# EAGLE design vent bjt2 i2c pwm small (EAGLE 9.5.0)
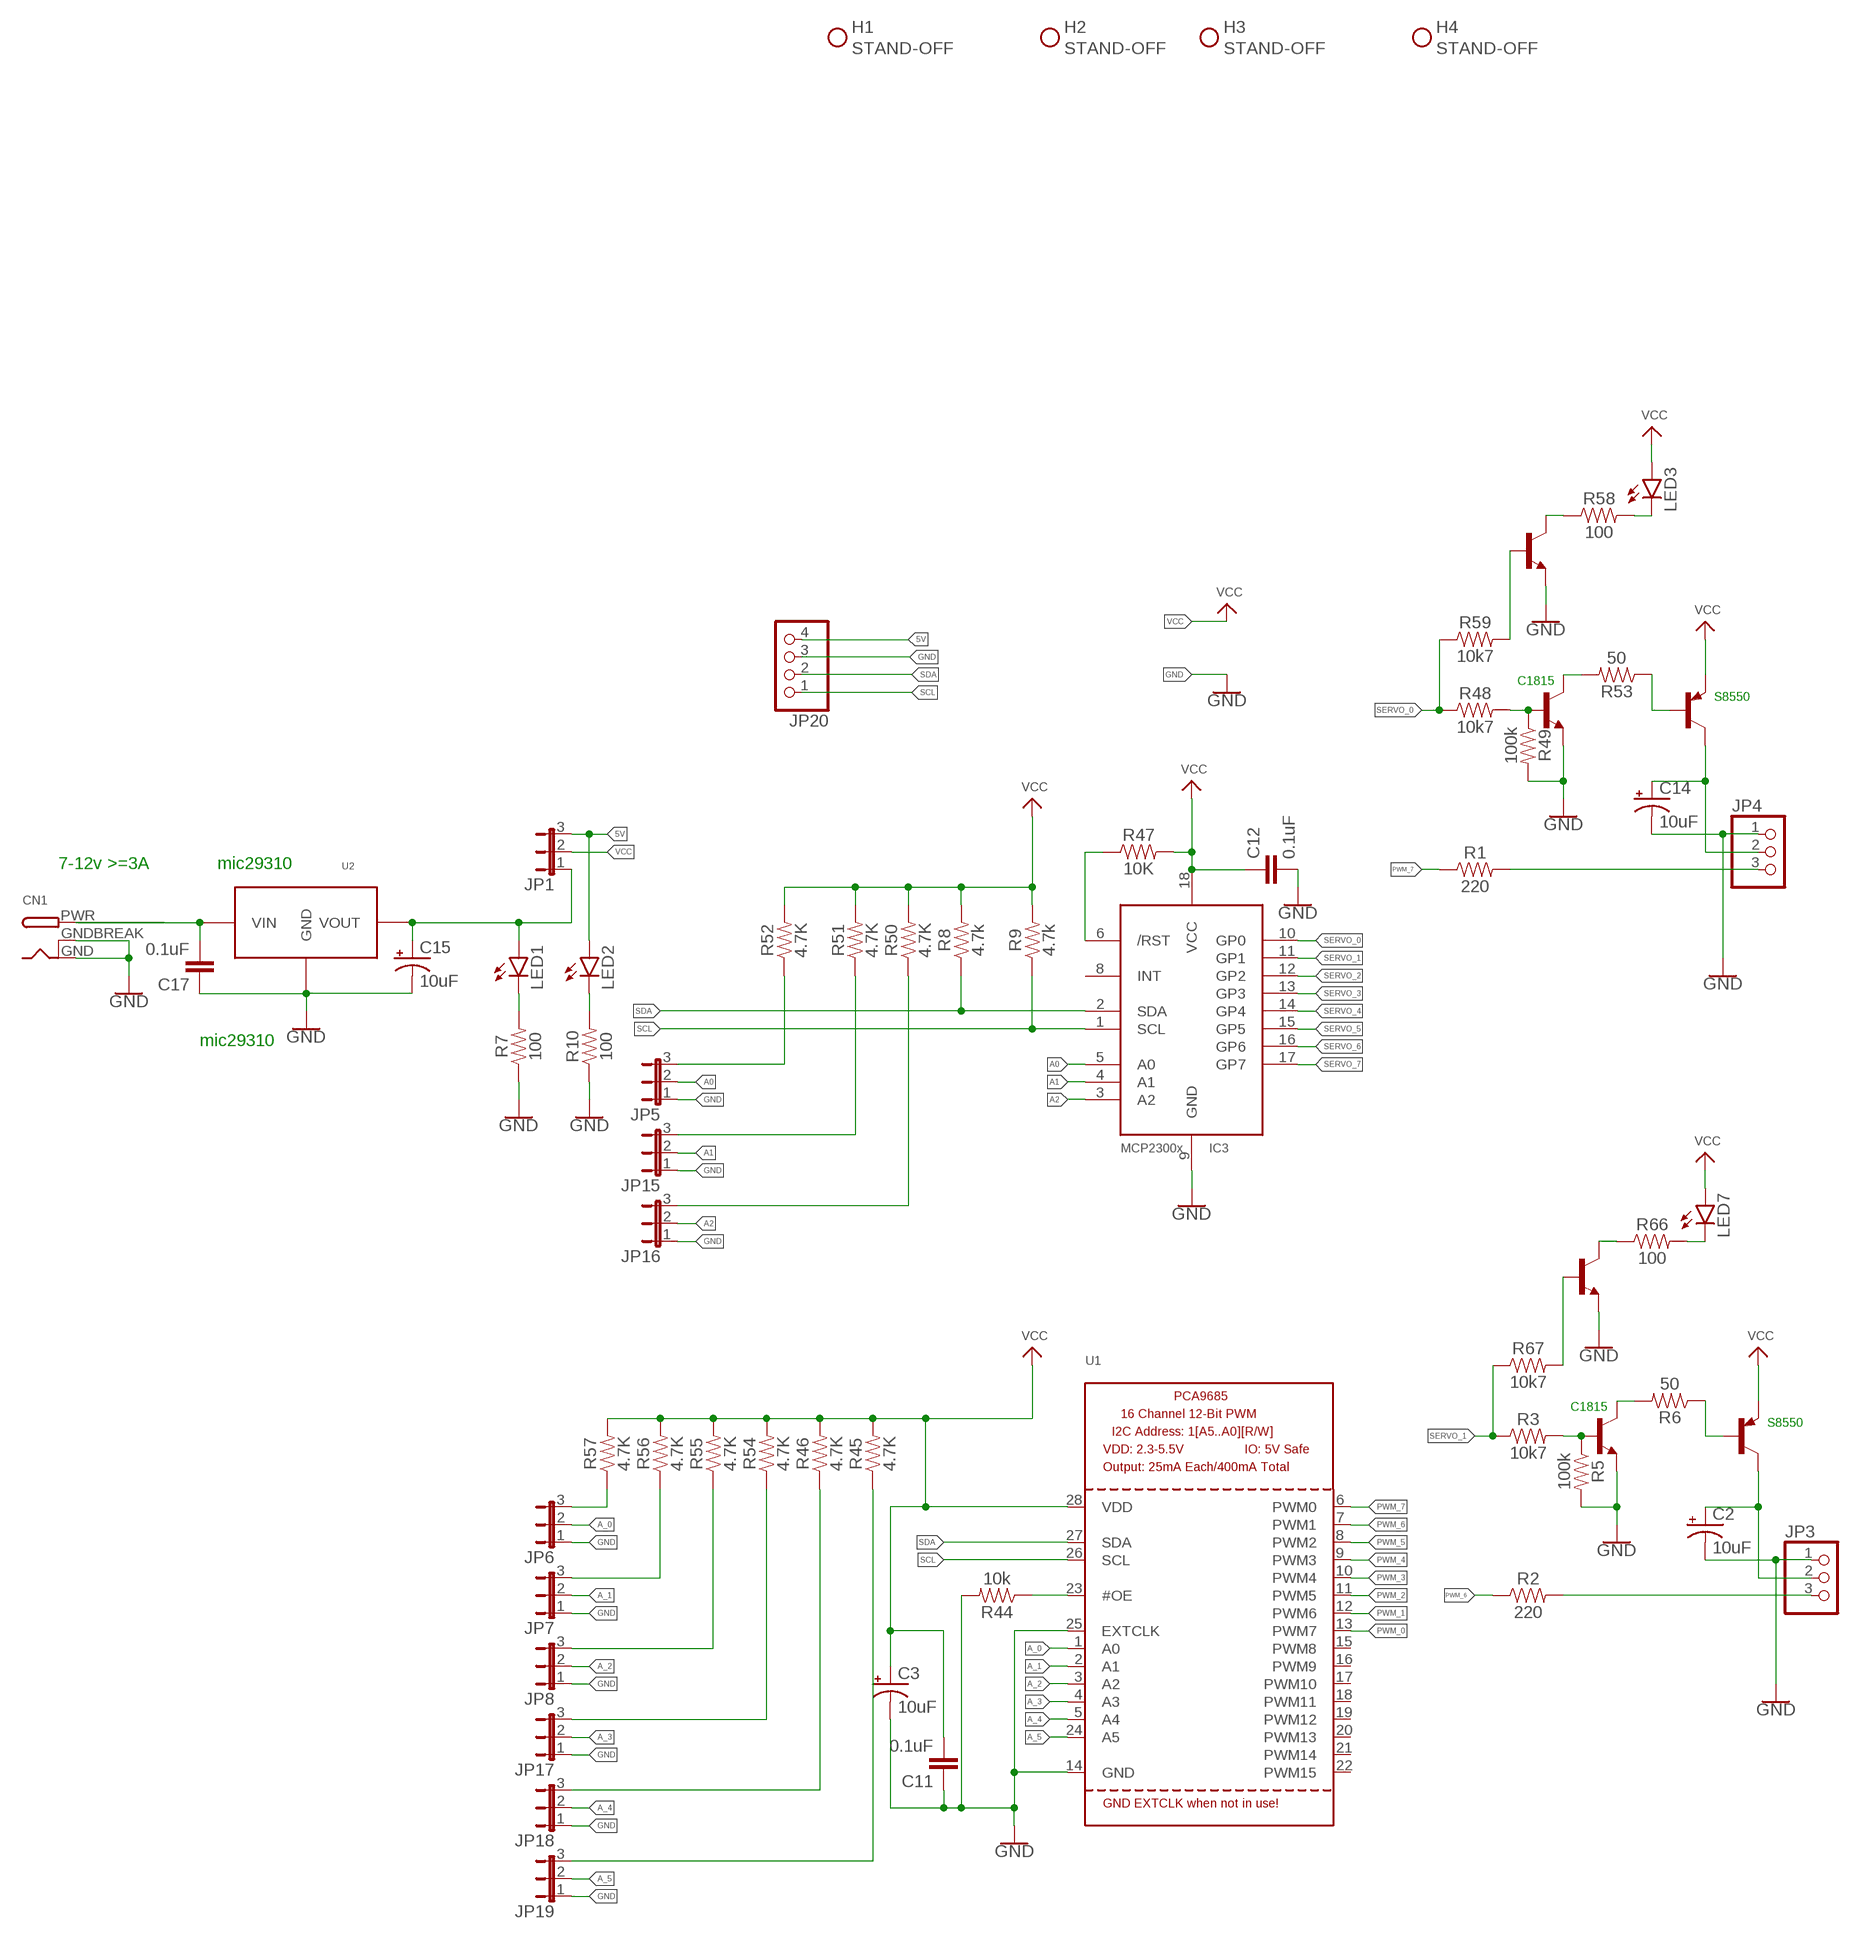
[diagram p0: schematic, sheet 1, part 1 of 2]
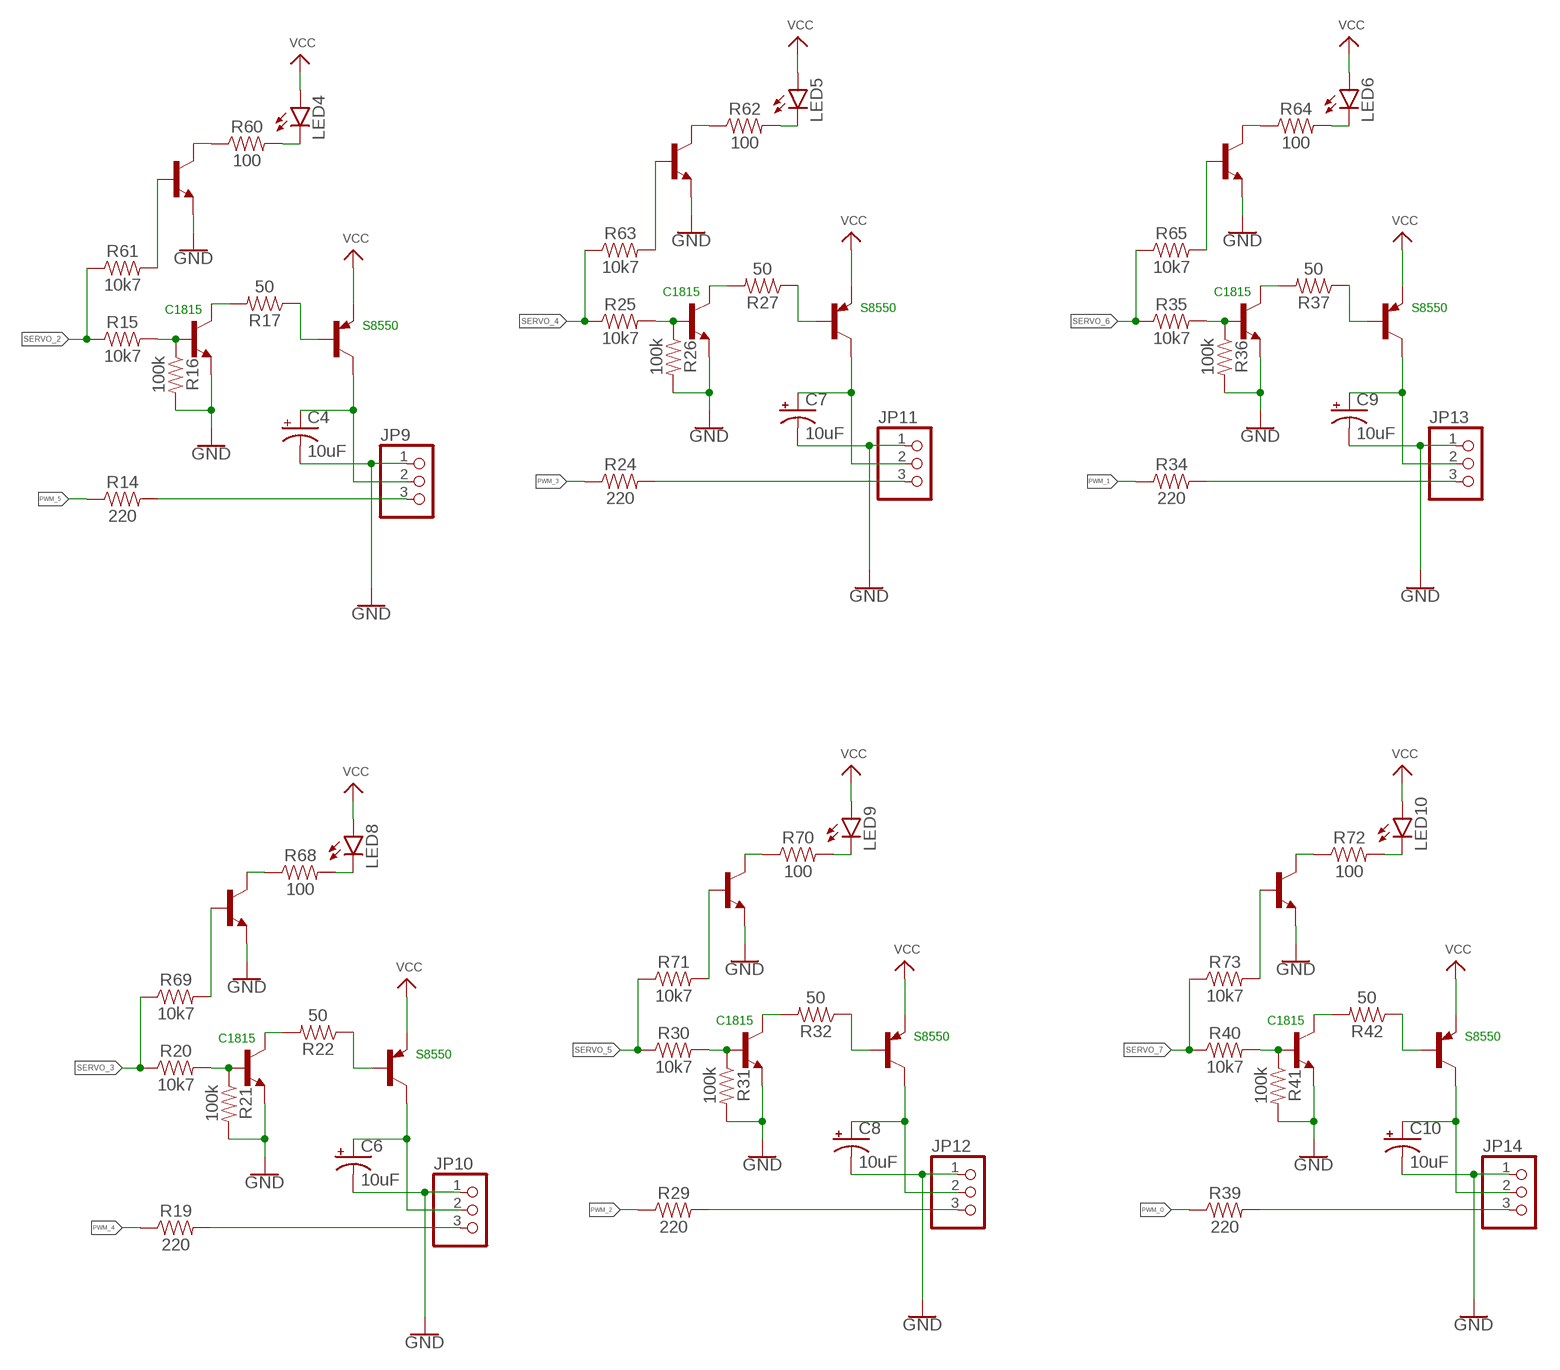
[diagram p1: schematic, sheet 1, part 2 of 2]

## Parts
C2  10uF  10UF-POLAR-RADIAL-2.5MM-25V-20%  [CPOL-RADIAL-2.5MM-5MM]
C3  10uF  10UF-POLAR-RADIAL-2.5MM-25V-20%  [CPOL-RADIAL-2.5MM-5MM]
C4  10uF  10UF-POLAR-RADIAL-2.5MM-25V-20%  [CPOL-RADIAL-2.5MM-5MM]
C6  10uF  10UF-POLAR-RADIAL-2.5MM-25V-20%  [CPOL-RADIAL-2.5MM-5MM]
C7  10uF  10UF-POLAR-RADIAL-2.5MM-25V-20%  [CPOL-RADIAL-2.5MM-5MM]
C8  10uF  10UF-POLAR-RADIAL-2.5MM-25V-20%  [CPOL-RADIAL-2.5MM-5MM]
C9  10uF  10UF-POLAR-RADIAL-2.5MM-25V-20%  [CPOL-RADIAL-2.5MM-5MM]
C10  10uF  10UF-POLAR-RADIAL-2.5MM-25V-20%  [CPOL-RADIAL-2.5MM-5MM]
C11  0.1uF  0.1UF-KIT-EZ-50V-20%  [CAP-PTH-SMALL-KIT]
C12  0.1uF  0.1UF-KIT-EZ-50V-20%  [CAP-PTH-SMALL-KIT]
C14  10uF  10UF-POLAR-RADIAL-2.5MM-25V-20%  [CPOL-RADIAL-2.5MM-5MM]
C15  10uF  10UF-POLAR-RADIAL-2.5MM-25V-20%  [CPOL-RADIAL-2.5MM-5MM]
C17  0.1uF  0.1UF-KIT-EZ-50V-20%  [CAP-PTH-SMALL-KIT]
CN1  DCBARRELPTH  [DCJACK_2MM_PTH]
H1  STAND-OFF  [STAND-OFF]
H2  STAND-OFF  [STAND-OFF]
H3  STAND-OFF  [STAND-OFF]
H4  STAND-OFF  [STAND-OFF]
IC3  MCP23008/P  [DIL18]
JP1  JP2E  [JP2]
JP3  PINHD-1X3  [1X03]
JP4  PINHD-1X3  [1X03]
JP5  JP2E  [JP2]
JP6  JP2E  [JP2]
JP7  JP2E  [JP2]
JP8  JP2E  [JP2]
JP9  PINHD-1X3  [1X03]
JP10  PINHD-1X3  [1X03]
JP11  PINHD-1X3  [1X03]
JP12  PINHD-1X3  [1X03]
JP13  PINHD-1X3  [1X03]
JP14  PINHD-1X3  [1X03]
JP15  JP2E  [JP2]
JP16  JP2E  [JP2]
JP17  JP2E  [JP2]
JP18  JP2E  [JP2]
JP19  JP2E  [JP2]
JP20  PINHD-1X4  [1X04]
LED1  LEDCHIPLED_1206  [CHIPLED_1206]
LED2  LEDCHIPLED_1206  [CHIPLED_1206]
LED3  LEDCHIPLED_1206  [CHIPLED_1206]
LED4  LEDCHIPLED_1206  [CHIPLED_1206]
LED5  LEDCHIPLED_1206  [CHIPLED_1206]
LED6  LEDCHIPLED_1206  [CHIPLED_1206]
LED7  LEDCHIPLED_1206  [CHIPLED_1206]
LED8  LEDCHIPLED_1206  [CHIPLED_1206]
LED9  LEDCHIPLED_1206  [CHIPLED_1206]
LED10  LEDCHIPLED_1206  [CHIPLED_1206]
Q1  2N2907  [TO92-EBC-OVAL]
Q2  2N2907  [TO92-EBC-OVAL]
Q3  2N2907  [TO92-EBC-OVAL]
Q4  2N2907  [TO92-EBC-OVAL]
Q5  2N2907  [TO92-EBC-OVAL]
Q6  2N2907  [TO92-EBC-OVAL]
Q7  2N2907  [TO92-EBC-OVAL]
Q9  2N2907  [TO92-EBC-OVAL]
R1  220  10KOHM-HORIZ-1/4W-1%  [AXIAL-0.3]
R2  220  10KOHM-HORIZ-1/4W-1%  [AXIAL-0.3]
R3  10k7  10KOHM-HORIZ-1/4W-1%  [AXIAL-0.3]
R5  100k  10KOHM-HORIZ-1/4W-1%  [AXIAL-0.3]
R6  50  10KOHM-HORIZ-1/4W-1%  [AXIAL-0.3]
R7  100  10KOHM-HORIZ-1/4W-1%  [AXIAL-0.3]
R8  4.7k  10KOHM-HORIZ-1/4W-1%  [AXIAL-0.3]
R9  4.7k  10KOHM-HORIZ-1/4W-1%  [AXIAL-0.3]
R10  100  10KOHM-HORIZ-1/4W-1%  [AXIAL-0.3]
R14  220  10KOHM-HORIZ-1/4W-1%  [AXIAL-0.3]
R15  10k7  10KOHM-HORIZ-1/4W-1%  [AXIAL-0.3]
R16  100k  10KOHM-HORIZ-1/4W-1%  [AXIAL-0.3]
R17  50  10KOHM-HORIZ-1/4W-1%  [AXIAL-0.3]
R19  220  10KOHM-HORIZ-1/4W-1%  [AXIAL-0.3]
R20  10k7  10KOHM-HORIZ-1/4W-1%  [AXIAL-0.3]
R21  100k  10KOHM-HORIZ-1/4W-1%  [AXIAL-0.3]
R22  50  10KOHM-HORIZ-1/4W-1%  [AXIAL-0.3]
R24  220  10KOHM-HORIZ-1/4W-1%  [AXIAL-0.3]
R25  10k7  10KOHM-HORIZ-1/4W-1%  [AXIAL-0.3]
R26  100k  10KOHM-HORIZ-1/4W-1%  [AXIAL-0.3]
R27  50  10KOHM-HORIZ-1/4W-1%  [AXIAL-0.3]
R29  220  10KOHM-HORIZ-1/4W-1%  [AXIAL-0.3]
R30  10k7  10KOHM-HORIZ-1/4W-1%  [AXIAL-0.3]
R31  100k  10KOHM-HORIZ-1/4W-1%  [AXIAL-0.3]
R32  50  10KOHM-HORIZ-1/4W-1%  [AXIAL-0.3]
R34  220  10KOHM-HORIZ-1/4W-1%  [AXIAL-0.3]
R35  10k7  10KOHM-HORIZ-1/4W-1%  [AXIAL-0.3]
R36  100k  10KOHM-HORIZ-1/4W-1%  [AXIAL-0.3]
R37  50  10KOHM-HORIZ-1/4W-1%  [AXIAL-0.3]
R39  220  10KOHM-HORIZ-1/4W-1%  [AXIAL-0.3]
R40  10k7  10KOHM-HORIZ-1/4W-1%  [AXIAL-0.3]
R41  100k  10KOHM-HORIZ-1/4W-1%  [AXIAL-0.3]
R42  50  10KOHM-HORIZ-1/4W-1%  [AXIAL-0.3]
R44  10k  10KOHM-HORIZ-1/4W-1%  [AXIAL-0.3]
R45  4.7K  10KOHM-HORIZ-1/4W-1%  [AXIAL-0.3]
R46  4.7K  10KOHM-HORIZ-1/4W-1%  [AXIAL-0.3]
R47  10K  10KOHM-HORIZ-1/4W-1%  [AXIAL-0.3]
R48  10k7  10KOHM-HORIZ-1/4W-1%  [AXIAL-0.3]
R49  100k  10KOHM-HORIZ-1/4W-1%  [AXIAL-0.3]
R50  4.7K  10KOHM-HORIZ-1/4W-1%  [AXIAL-0.3]
R51  4.7K  10KOHM-HORIZ-1/4W-1%  [AXIAL-0.3]
R52  4.7K  10KOHM-HORIZ-1/4W-1%  [AXIAL-0.3]
R53  50  10KOHM-HORIZ-1/4W-1%  [AXIAL-0.3]
R54  4.7K  10KOHM-HORIZ-1/4W-1%  [AXIAL-0.3]
R55  4.7K  10KOHM-HORIZ-1/4W-1%  [AXIAL-0.3]
R56  4.7K  10KOHM-HORIZ-1/4W-1%  [AXIAL-0.3]
R57  4.7K  10KOHM-HORIZ-1/4W-1%  [AXIAL-0.3]
R58  100  10KOHM-HORIZ-1/4W-1%  [AXIAL-0.3]
R59  10k7  10KOHM-HORIZ-1/4W-1%  [AXIAL-0.3]
R60  100  10KOHM-HORIZ-1/4W-1%  [AXIAL-0.3]
R61  10k7  10KOHM-HORIZ-1/4W-1%  [AXIAL-0.3]
R62  100  10KOHM-HORIZ-1/4W-1%  [AXIAL-0.3]
R63  10k7  10KOHM-HORIZ-1/4W-1%  [AXIAL-0.3]
R64  100  10KOHM-HORIZ-1/4W-1%  [AXIAL-0.3]
R65  10k7  10KOHM-HORIZ-1/4W-1%  [AXIAL-0.3]
R66  100  10KOHM-HORIZ-1/4W-1%  [AXIAL-0.3]
R67  10k7  10KOHM-HORIZ-1/4W-1%  [AXIAL-0.3]
R68  100  10KOHM-HORIZ-1/4W-1%  [AXIAL-0.3]
R69  10k7  10KOHM-HORIZ-1/4W-1%  [AXIAL-0.3]
R70  100  10KOHM-HORIZ-1/4W-1%  [AXIAL-0.3]
R71  10k7  10KOHM-HORIZ-1/4W-1%  [AXIAL-0.3]
R72  100  10KOHM-HORIZ-1/4W-1%  [AXIAL-0.3]
R73  10k7  10KOHM-HORIZ-1/4W-1%  [AXIAL-0.3]
T1  2SC1815  [TO92-ECB]
T2  2SC1815  [TO92-ECB]
T3  2SC1815  [TO92-ECB]
T4  2SC1815  [TO92-ECB]
T5  2SC1815  [TO92-ECB]
T6  2SC1815  [TO92-ECB]
T7  2SC1815  [TO92-ECB]
T9  2SC1815  [TO92-ECB]
U1  PCA9685  [TSSOP28]
U2  MIC29310_TO-263  [TO263-3]
U3  S9018  [TO92-EBC]
U4  S9018  [TO92-EBC]
U5  S9018  [TO92-EBC]
U6  S9018  [TO92-EBC]
U7  S9018  [TO92-EBC]
U8  S9018  [TO92-EBC]
U9  S9018  [TO92-EBC]
U10  S9018  [TO92-EBC]

## Nets
5V [power]: JP1.3 JP20.4 LED2.A
5V_REG [HI_POWER]: C15.1(+) JP1.1 LED1.A U2.3(VOUT)
A0 [Signal]: IC3.5(A0) JP5.2
A1 [Signal]: IC3.4(A1) JP15.2
A2 [Signal]: IC3.3(A2) JP16.2
A_0 [Signal]: JP6.2 U1.1(A0)
A_1 [Signal]: JP7.2 U1.2(A1)
A_2 [Signal]: JP8.2 U1.3(A2)
A_3 [Signal]: JP17.2 U1.4(A3)
A_4 [Signal]: JP18.2 U1.5(A4)
A_5 [Signal]: JP19.2 U1.24(A5)
GND [HI_POWER]: C2.2(-) C3.2(-) C4.2(-) C6.2(-) C7.2(-) C8.2(-) C9.2(-) C10.2(-) C11.1 C12.2 C14.2(-) C15.2(-) C17.1 CN1.GND CN1.GNDBREAK IC3.9(GND) JP3.1 JP4.1 JP5.1 JP6.1 JP7.1 JP8.1 JP9.1 JP10.1 JP11.1 JP12.1 JP13.1 JP14.1 JP15.1 JP16.1 JP17.1 JP18.1 JP19.1 JP20.3 R5.P$2 R7.P$1 R10.P$1 R16.P$2 R21.P$2 R26.P$2 R31.P$2 R36.P$2 R41.P$2 R44.P$2 R49.P$2 T1.E T2.E T3.E T4.E T5.E T6.E T7.E T9.E U1.14(GND) U1.25(EXTCLK) U2.2(GND) U2.TAB(GND) U3.E U4.E U5.E U6.E U7.E U8.E U9.E U10.E
N$1 [Signal]: JP4.3 R1.P$2
N$2 [Signal]: JP3.3 R2.P$2
N$3 [power]: Q9.B R53.P$1
N$4 [Signal]: R3.P$2 R5.P$1 T1.B
N$5 [power]: R6.P$2 T1.C
N$6 [Signal]: JP8.3 R55.P$1
N$7 [power]: C2.1(+) JP3.2 Q1.C
N$8 [HI_POWER]: C17.2 CN1.PWR U2.1(VIN)
N$9 [power]: Q1.B R6.P$1
N$10 [Signal]: JP9.3 R14.P$2
N$11 [Signal]: JP6.3 R57.P$1
N$12 [Signal]: JP7.3 R56.P$1
N$13: R44.P$1 U1.23(#OE)
N$14 [Signal]: LED1.C R7.P$2
N$15 [Signal]: LED2.C R10.P$2
N$16 [power]: R58.P$1 U3.C
N$18 [Signal]: JP17.3 R54.P$1
N$19 [Signal]: JP18.3 R46.P$1
N$20 [Signal]: R15.P$2 R16.P$1 T2.B
N$21 [power]: R17.P$2 T2.C
N$22 [power]: C4.1(+) JP9.2 Q2.C
N$23 [power]: Q2.B R17.P$1
N$24: JP10.3 R19.P$2
N$25 [power]: R20.P$2 R21.P$1 T3.B
N$26 [power]: R22.P$2 T3.C
N$27 [power]: C6.1(+) JP10.2 Q3.C
N$28 [power]: Q3.B R22.P$1
N$29: JP11.3 R24.P$2
N$30 [power]: R25.P$2 R26.P$1 T4.B
N$31 [power]: R27.P$2 T4.C
N$32 [power]: C7.1(+) JP11.2 Q4.C
N$33 [power]: Q4.B R27.P$1
N$34: JP12.3 R29.P$2
N$35 [power]: R30.P$2 R31.P$1 T5.B
N$36 [power]: R32.P$2 T5.C
N$37 [power]: C8.1(+) JP12.2 Q5.C
N$38 [power]: Q5.B R32.P$1
N$39: JP13.3 R34.P$2
N$40 [power]: R35.P$2 R36.P$1 T6.B
N$41: R37.P$2 T6.C
N$42 [power]: C9.1(+) JP13.2 Q6.C
N$43 [power]: Q6.B R37.P$1
N$44 [Signal]: JP19.3 R45.P$1
N$45 [Signal]: JP5.3 R52.P$1
N$46 [Signal]: JP15.3 R51.P$1
N$47 [Signal]: JP16.3 R50.P$1
N$48 [Signal]: IC3.6(/RST) R47.P$1
N$49: JP14.3 R39.P$2
N$50 [Signal]: R48.P$2 R49.P$1 T9.B
N$51 [power]: R53.P$2 T9.C
N$52 [power]: R40.P$2 R41.P$1 T7.B
N$53 [power]: C14.1(+) JP4.2 Q9.C
N$54 [power]: R42.P$2 T7.C
N$55 [power]: C10.1(+) JP14.2 Q7.C
N$56 [power]: Q7.B R42.P$1
N$57 [power]: LED3.C R58.P$2
N$58 [Signal]: R59.P$2 U3.B
N$59 [power]: R60.P$1 U4.C
N$60 [power]: LED4.C R60.P$2
N$61 [Signal]: R61.P$2 U4.B
N$62: R62.P$1 U5.C
N$63: LED5.C R62.P$2
N$64: R63.P$2 U5.B
N$65: R64.P$1 U6.C
N$66: LED6.C R64.P$2
N$67: R65.P$2 U6.B
N$68 [power]: R66.P$1 U7.C
N$69 [power]: LED7.C R66.P$2
N$70 [Signal]: R67.P$2 U7.B
N$71: R68.P$1 U8.C
N$72: LED8.C R68.P$2
N$73: R69.P$2 U8.B
N$74: R70.P$1 U9.C
N$75: LED9.C R70.P$2
N$76: R71.P$2 U9.B
N$77: R72.P$1 U10.C
N$78: LED10.C R72.P$2
N$79: R73.P$2 U10.B
PWM_0 [Signal]: R39.P$1 U1.13(PWM7)
PWM_1 [Signal]: R34.P$1 U1.12(PWM6)
PWM_2 [Signal]: R29.P$1 U1.11(PWM5)
PWM_3 [Signal]: R24.P$1 U1.10(PWM4)
PWM_4 [Signal]: R19.P$1 U1.9(PWM3)
PWM_5 [Signal]: R14.P$1 U1.8(PWM2)
PWM_6 [Signal]: R2.P$1 U1.7(PWM1)
PWM_7 [Signal]: R1.P$1 U1.6(PWM0)
SCL [Signal]: IC3.1(SCL) JP20.1 R9.P$1 U1.26(SCL)
SDA [Signal]: IC3.2(SDA) JP20.2 R8.P$1 U1.27(SDA)
SERVO_0 [Signal]: IC3.10(GP0) R48.P$1 R59.P$1
SERVO_1 [Signal]: IC3.11(GP1) R3.P$1 R67.P$1
SERVO_2 [Signal]: IC3.12(GP2) R15.P$1 R61.P$1
SERVO_3 [Signal]: IC3.13(GP3) R20.P$1 R69.P$1
SERVO_4 [Signal]: IC3.14(GP4) R25.P$1 R63.P$1
SERVO_5 [Signal]: IC3.15(GP5) R30.P$1 R71.P$1
SERVO_6 [Signal]: IC3.16(GP6) R35.P$1 R65.P$1
SERVO_7 [Signal]: IC3.17(GP7) R40.P$1 R73.P$1
VCC [power]: C3.1(+) C11.2 C12.1 IC3.18(VCC) JP1.2 LED3.A LED4.A LED5.A LED6.A LED7.A LED8.A LED9.A LED10.A Q1.E Q2.E Q3.E Q4.E Q5.E Q6.E Q7.E Q9.E R8.P$2 R9.P$2 R45.P$2 R46.P$2 R47.P$2 R50.P$2 R51.P$2 R52.P$2 R54.P$2 R55.P$2 R56.P$2 R57.P$2 U1.28(VDD)
Unconnected: IC3.8(INT) U1.15(PWM8) U1.16(PWM9) U1.17(PWM10) U1.18(PWM11) U1.19(PWM12) U1.20(PWM13) U1.21(PWM14) U1.22(PWM15)

## Notes on the sheet
- C1815 | C1815
- C1815 | C1815 | S8550 | S8550
- S8550 | S8550
- 7-12v >=3A | mic29310
- mic29310
- C1815 | C1815
- C1815 | C1815 | S8550 | S8550
- S8550 | S8550

## Library data of the parts
C2-C4 C6-C10 C14 C15 = SparkFun-Capacitors:10UF-POLAR: 10.0µF polarized capacitors A capacitor is a passive two-terminal electrical component used to store electrical energy temporarily in an electric field.; PROD_ID: CAP-08440
C11 C12 C17 = SparkFun-Capacitors:0.1UF: 0.1µF ceramic capacitors A capacitor is a passive two-terminal electrical component used to store electrical energy temporarily in an electric field.; PROD_ID: CAP-08370
CN1 = adafruit:DCBARREL: 2.0mm DC Barrel Jack DCJACK_2MM_PTH - Through Hole Jack (4UConnector: 05537)
H1-H4 = SparkFun-Hardware:STAND-OFF: Stand Off Drill holes for mechanically mounting via screws, standoffs, etc. Note: Use the keepout ring to avoid running the screw head into surrounding components. Variant Overviews STAND-OFF - Mechanical footprint for a #4 phillips button head screw. STAND-OFF-TIGHT - Mechanical footprint for a #4 phillips button head screw, Example SparkFun Products Screw - Phillips Head (1/4", 4-40, 10 pack) <https://www.sparkfun.com/products/10453> (PRT-10453) Screw - Phillips Head (1/2", 4-40, 10 pack) <https://www.sparkfun.com/products/10452> (PRT-10452) Screw - Phillips Head (3/4", 4-40, 10 pack) <https://www.sparkfun.com/products/10451> (PRT-10451) Screw - Phillips Head (1", 4-40, 10 pack) <https://www.sparkfun.com/products/10450> (PRT-10450)
IC3 = adafruit:MCP23008: MCP23008 Inexpensive i2c i/o expander - 8 general purpose i/o pins with optional pullups
JP1 JP5-JP8 JP15-JP19 = jumper:JP2E: JUMPER
JP3 JP4 JP9-JP14 = adafruit:PINHD-1X3: PIN HEADER
JP20 = pinhead:PINHD-1X4: PIN HEADER
LED1-LED10 = led:LED: LED OSRAM: - CHIPLED LG R971, LG N971, LY N971, LG Q971, LY Q971, LO R971, LY R971 LH N974, LH R974 LS Q976, LO Q976, LY Q976 LO Q996 - Hyper CHIPLED LW Q18S LB Q993, LB Q99A, LB R99A - SideLED LS A670, LO A670, LY A670, LG A670, LP A670 LB A673, LV A673, LT A673, LW A673 LH A674 LY A675 LS A676, LA A676, LO A676, LY A676, LW A676 LS A679, LY A679, LG A679 - Hyper Micro SIDELED® LS Y876, LA Y876, LO Y876, LY Y876 LT Y87S - SmartLED LW L88C, LW L88S LB L89C, LB L89S, LG L890 LS L89K, LO L89K, LY L89K LS L896, LA L896, LO L896, LY L896 - TOPLED LS T670, LO T670, LY T670, LG T670, LP T670 LSG T670, LSP T670, LSY T670, LOP T670, LYG T670 LG T671, LOG T671, LSG T671 LB T673, LV T673, LT T673, LW T673 LH T674 LS T676, LA T676, LO T676, LY T676, LB T676, LH T676, LSB T676, LW T676 LB T67C, LV T67C, LT T67C, LS T67K, LO T67K, LY T67K, LW E67C LS E67B, LA E67B, LO E67B, LY E67B, LB E67C, LV E67C, LT E67C LW T67C LS T679, LY T679, LG T679 LS T770, LO T770, LY T770, LG T770, LP T770 LB T773, LV T773, LT T773, LW T773 LH T774 LS E675, LA E675, LY E675, LS T675 LS T776, LA T776, LO T776, LY T776, LB T776 LHGB T686 LT T68C, LB T68C - Hyper Mini TOPLED® LB M676 - Mini TOPLED Santana® LG M470 LS M47K, LO M47K, LY M47K Source: http://www.osram.convergy.de LUXEON: - LUMILED® LXK2-PW12-R00, LXK2-PW12-S00, LXK2-PW14-U00, LXK2-PW14-V00 LXK2-PM12-R00, LXK2-PM12-S00, LXK2-PM14-U00 LXK2-PE12-Q00, LXK2-PE12-R00, LXK2-PE12-S00, LXK2-PE14-T00, LXK2-PE14-U00 LXK2-PB12-K00, LXK2-PB12-L00, LXK2-PB12-M00, LXK2-PB14-N00, LXK2-PB14-P00, LXK2-PB14-Q00 LXK2-PR12-L00, LXK2-PR12-M00, LXK2-PR14-Q00, LXK2-PR14-R00 LXK2-PD12-Q00, LXK2-PD12-R00, LXK2-PD12-S00 LXK2-PH12-R00, LXK2-PH12-S00 LXK2-PL12-P00, LXK2-PL12-Q00, LXK2-PL12-R00 Source: www.luxeon.com KINGBRIGHT: KA-3528ASYC Source: www.kingbright.com
Q1-Q7 Q9 = adafruit:2N2907*: PNP Transistor Big Oval pads
R1-R3 R5-R10 R14-R17 R19-R22 R24-R27 R29-R32 R34-R37 R39-R42 R45-R73 = SparkFun-Resistors:10KOHM: 10kΩ resistor A resistor is a passive two-terminal electrical component that implements electrical resistance as a circuit element. Resistors act to reduce current flow, and, at the same time, act to lower voltage levels within circuits. - Wikipedia; PROD_ID: RES-12183; VALUE: 10k
R44 = SparkFun-Resistors:10KOHM: 10kΩ resistor A resistor is a passive two-terminal electrical component that implements electrical resistance as a circuit element. Resistors act to reduce current flow, and, at the same time, act to lower voltage levels within circuits. - Wikipedia; PROD_ID: RES-12183
T1-T7 T9 = transistor:2SC1815: NPN EPITAXIAL TRANSISTOR Source: TOSHIBA .. 2SC1815 1.pdf
U1 = adafruit:PCA9685: PCA9685 - 16 Channel 12-Bit I2C PWM Controller 5.0V tolerant 16 channel, 12-bit I2C PWM controller with 25mA per output (max. 400mA total) Digikey: 568-5931-1-ND
U2 = mic29310:MIC29310_TO-263: MIC29310-5WU LDO
U3-U10 = S9018:S9018: S9018 npn BJT

## Net classes
1 power: width 0.381 mm, clearance 0.254 mm
2 HI_POWER: width 0.762 mm

## Board
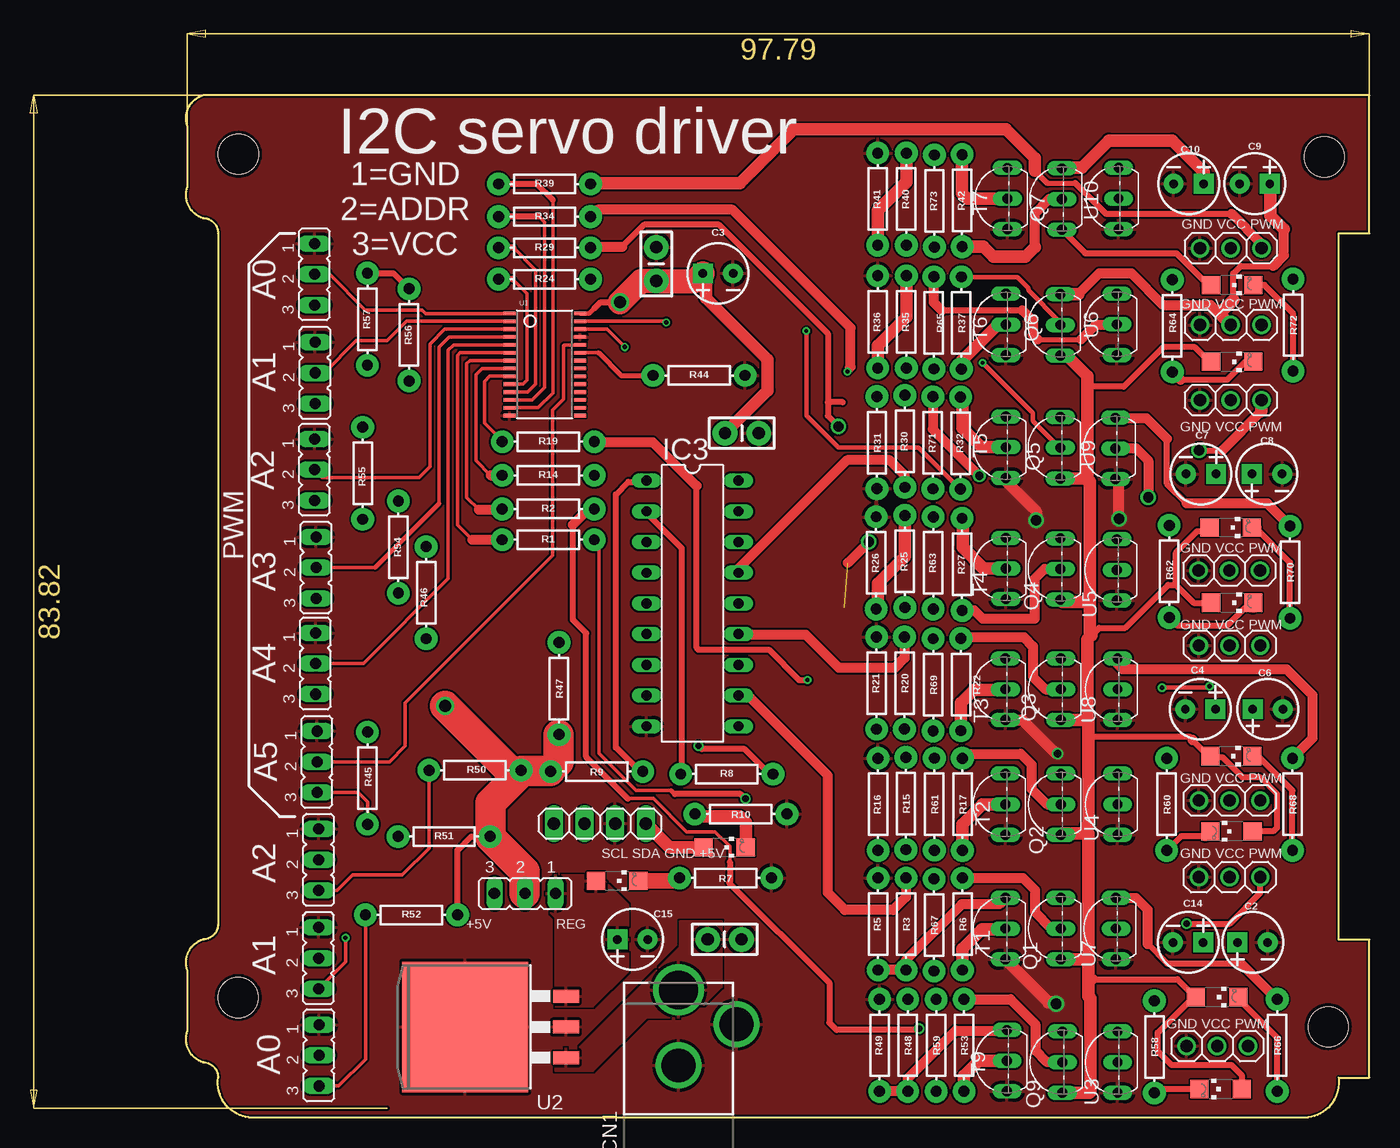
[diagram p2: board, top side]
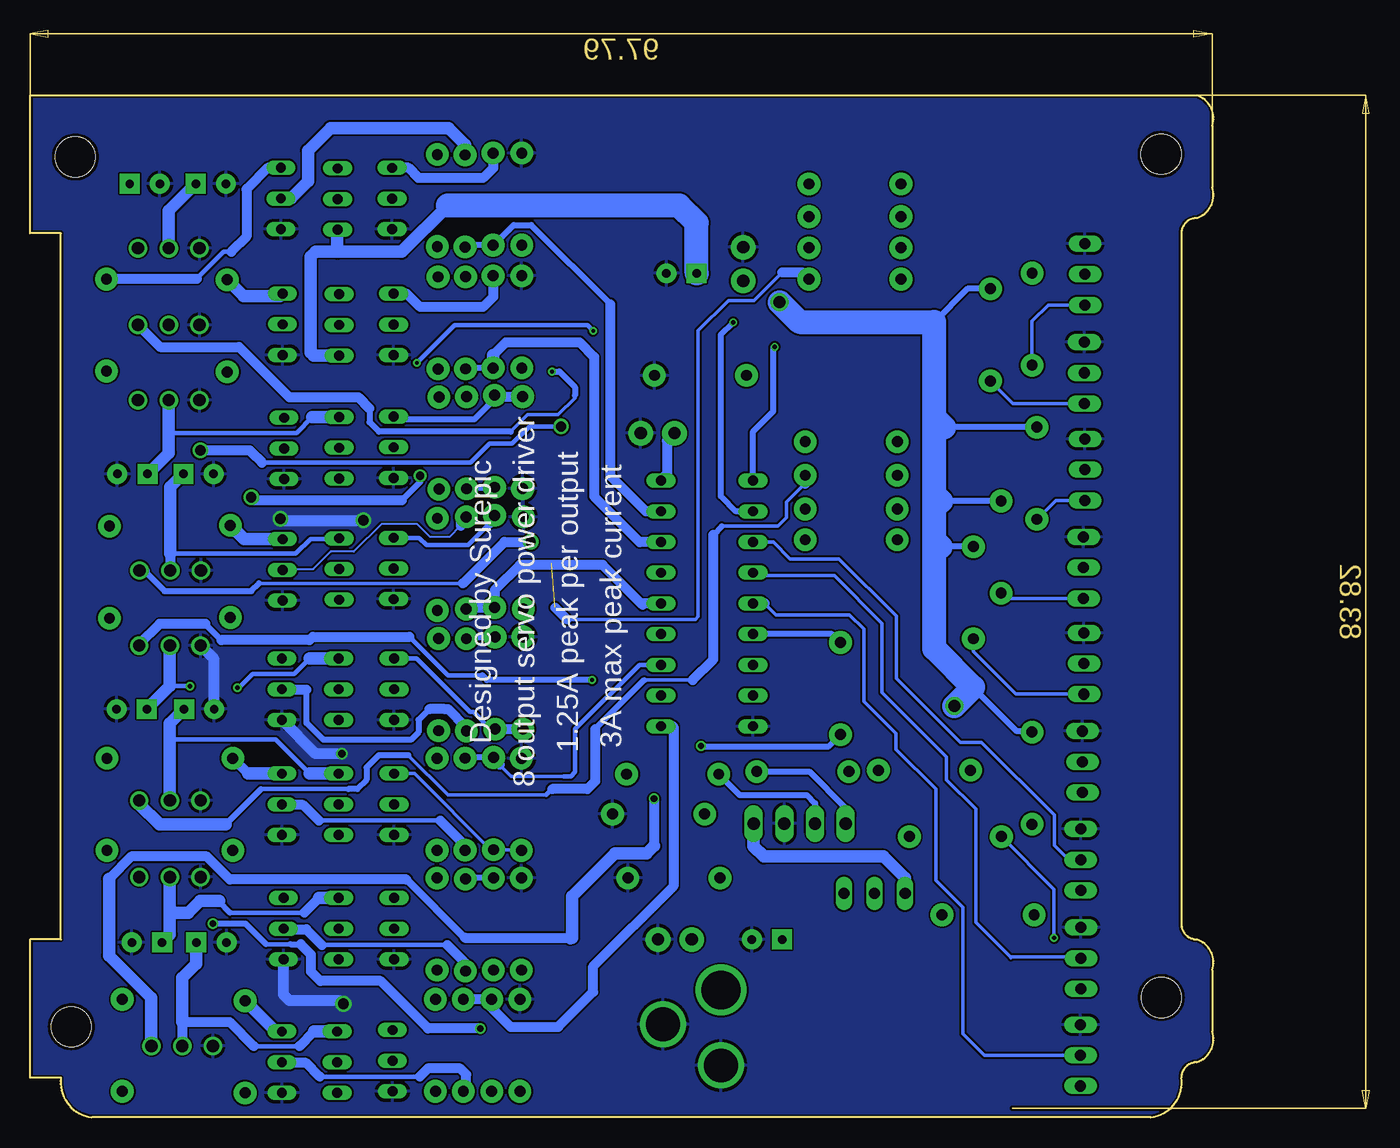
[diagram p3: board, bottom side, seen from below]

Size 97.89 x 84.58 mm. Coordinates in mm from the lower left corner, seen from the top.
Outline: 0.1,82.04 0.1,76.96 arc90 1.37,74.42 arc-90 2.64,73.15 2.64,16 arc-90 1.37,14.73 arc90 0.1,12.19 0.1,7.11 arc90 1.37,4.57 arc-90 2.64,3.3 arc90 5.18,0 92.81,0 arc90 95.35,3.3 97.89,3.3 97.89,14.73 95.35,14.73 95.35,73.15 97.89,73.15 97.89,84.58 1.37,84.58 arc90 0.1,82.04
Copper layers (1*16): Top 0.035mm / dielectric 1.5mm / Bottom 0.035mm
Design rules "SparkFun-2-layer-PCBWay-LIMIT": minimum track width 6mil, minimum drill 0.3mm, track to track 6mil, track to pad 6mil, pad to pad 6mil, via to via 6mil, smd to smd 6mil, copper to edge 6mil, drill to drill 6mil, minimum pad ring 6mil, minimum via ring 6mil, stop-mask expansion 4mil, vias tented up to drill 25mil, thermal gap 10mil

### Footprints (pad centres in the part's own frame; a part is rotated, then mirrored left to right if it is on the bottom)
CPOL-RADIAL-2.5MM-5MM = drill 0.7 pad 1.651 square: 1 1.25,0 | drill 0.7 pad 1.651: 2 -1.25,0
CAP-PTH-SMALL-KIT = drill 1.016 pad 2.032: 1 -1.397,0; 2 1.397,0
DCJACK_2MM_PTH = drill 2.8: GND 0,7.35; GNDBREAK 4.8,10.75 | drill 3.2: PWR 0,13.6
STAND-OFF = hole 3.302: 0,0
DIL18 = drill 0.813 long: 1 -10.16,-3.81; 2 -7.62,-3.81; 3 -5.08,-3.81; 4 -2.54,-3.81; 5 0,-3.81; 6 2.54,-3.81; 7 5.08,-3.81; 8 7.62,-3.81; 9 10.16,-3.81; 10 10.16,3.81; 11 7.62,3.81; 12 5.08,3.81; 13 2.54,3.81; 14 0,3.81; 15 -2.54,3.81; 16 -5.08,3.81; 17 -7.62,3.81; 18 -10.16,3.81
JP2 = drill 0.914 long: 1 -2.54,0; 2 0,0; 3 2.54,0
1X03 = drill 1.016: 1 -2.54,0; 2 0,0; 3 2.54,0
1X04 = drill 1.016 long: 1 -3.81,0; 2 -1.27,0; 3 1.27,0; 4 3.81,0
CHIPLED_1206 = smd 1.5 x 1.5: A 0,-1.75; C 0,1.75
TO92-EBC-OVAL = drill 0.813 long: B 0,-1.27; C 2.54,-1.27; E -2.54,-1.27
AXIAL-0.3 = drill 0.9 pad 1.88: P$1 -3.81,0; P$2 3.81,0
TO92-ECB = drill 0.813 long: B 2.54,0; C 0,0; E -2.54,0
TSSOP28 = smd 0.305 x 0.991: 1 -4.225,-2.918; 2 -3.575,-2.918; 3 -2.925,-2.918; 4 -2.275,-2.918; 5 -1.625,-2.918; 6 -0.975,-2.918; 7 -0.325,-2.918; 8 0.325,-2.918; 9 0.975,-2.918; 10 1.625,-2.918; 11 2.275,-2.918; 12 2.925,-2.918; 13 3.575,-2.918; 14 4.225,-2.918; 15 4.225,2.918; 16 3.575,2.918; 17 2.925,2.918; 18 2.275,2.918; 19 1.625,2.918; 20 0.975,2.918; 21 0.325,2.918; 22 -0.325,2.918; 23 -0.975,2.918; 24 -1.625,2.918; 25 -2.275,2.918; 26 -2.925,2.918; 27 -3.575,2.918; 28 -4.225,2.918
TO263-3 = smd 1.067 x 2.159: 1 -2.54,-5.791; 2 0,-5.791; 3 2.54,-5.791 | smd 10.8 x 10.41: TAB 0,2.54
TO92-EBC = drill 0.813 long: B 0,-1.27; C 2.54,-1.27; E -2.54,-1.27

### Placement (x,y rotation side)
C2  88.24,14.48 180 top
C3  44.01,69.84 180 top
C4  83.92,33.78 0 top
C6  89.5,33.78 180 top
C7  83.97,53.24 0 top
C8  89.43,53.24 180 top
C9  88.41,77.25 0 top
C10  82.95,77.25 0 top
C11  38.9,70.61 270 top
C12  45.98,56.62 0 top
C14  82.91,14.48 0 top
C15  36.93,14.73 180 top
C17  44.55,14.73 180 top
CN1  40.74,-3.05 0 top
H1  94.15,79.47 0 top
H2  94.49,7.51 0 top
H3  4.31,9.92 0 top
H4  4.33,79.7 0 top
IC3  41.9,42.53 270 top
JP1  28.04,18.54 180 top
JP3  86.33,19.89 0 top
JP4  85.31,5.91 0 top
JP5  10.99,5.14 270 top
JP6  10.62,69.77 270 top
JP7  10.67,61.61 270 top
JP8  10.62,53.6 270 top
JP9  86.33,26.23 0 top
JP10  86.33,39.05 0 top
JP11  86.3,45.26 0 top
JP12  86.43,59.35 0 top
JP13  86.43,65.58 0 top
JP14  86.43,71.93 0 top
JP15  10.95,13.18 270 top
JP16  10.97,21.32 270 top
JP17  10.75,45.49 270 top
JP18  10.7,37.56 270 top
JP19  10.83,29.42 270 top
JP20  34.23,24.31 0 top
LED1  35.66,19.58 270 top
LED2  44.55,22.35 270 top
LED3  85.59,2.36 90 top
LED4  86.49,23.68 90 top
LED5  86.56,42.59 270 top
LED6  86.56,62.53 270 top
LED7  85.29,9.96 270 top
LED8  86.48,29.89 270 top
LED9  86.43,48.81 270 top
LED10  86.56,68.88 270 top
Q1  71.09,15.62 90 top
Q2  71.09,25.91 90 top
Q3  71.09,35.43 90 top
Q4  71.06,45.38 90 top
Q5  71.06,55.42 90 top
Q6  71.06,65.58 90 top
Q7  71.19,75.99 90 top
Q9  71.22,4.57 90 top
R1  29.96,47.8 0 top
R2  29.96,50.35 0 top
R3  59.56,16 270 top
R5  57.25,16 90 top
R6  64.24,16 270 top
R7  44.63,19.81 180 top
R8  44.74,28.41 0 top
R9  33.97,28.62 180 top
R10  45.9,25.11 180 top
R14  29.96,53.13 0 top
R15  59.56,25.97 270 top
R16  57.25,25.91 90 top
R17  64.24,25.91 270 top
R19  29.96,55.91 0 top
R20  59.44,35.95 270 top
R21  57.12,35.94 90 top
R22  64.11,35.81 270 top
R24  29.65,69.36 0 top
R25  59.47,46.01 90 top
R26  57.09,45.89 90 top
R27  64.2,45.76 90 top
R29  29.65,71.96 0 top
R30  59.47,55.95 90 top
R31  57.16,55.84 270 top
R32  64.08,55.8 90 top
R34  29.65,74.54 0 top
R35  59.59,65.83 90 top
R36  57.22,65.83 90 top
R37  64.14,65.74 270 top
R39  29.65,77.24 0 top
R40  59.59,75.99 90 top
R41  57.22,75.99 90 top
R42  64.2,75.86 90 top
R44  42.44,61.4 0 top
R45  15.01,28.07 90 top
R46  19.86,43.42 90 top
R47  30.85,35.49 270 top
R48  59.7,5.97 270 top
R49  57.38,5.97 90 top
R50  23.9,28.73 0 top
R51  21.35,23.25 0 top
R52  18.65,16.76 0 top
R53  64.36,5.97 270 top
R54  17.56,47.2 90 top
R55  14.61,53.3 90 top
R56  18.44,64.76 90 top
R57  15,66.05 90 top
R58  80.11,5.84 270 top
R59  62.06,5.97 270 top
R60  81.13,25.91 270 top
R61  61.91,25.92 270 top
R62  81.34,45.18 270 top
R63  61.82,45.89 90 top
R64  81.59,65.5 270 top
R65  61.86,65.75 90 top
R66  90.27,5.97 270 top
R67  61.88,15.92 270 top
R68  91.54,25.91 270 top
R69  61.81,35.8 270 top
R70  91.33,45.12 270 top
R71  61.78,55.83 90 top
R72  91.59,65.56 270 top
R73  61.91,75.83 90 top
T1  67.79,15.62 90 top
T2  67.79,25.91 90 top
T3  67.79,35.43 90 top
T4  67.82,45.42 90 top
T5  67.82,55.45 90 top
T6  67.82,65.62 90 top
T7  67.95,76.03 90 top
T9  67.92,4.7 90 top
U1  29.66,62.3 270 top
U2  25.63,7.49 90 top
U3  75.79,4.57 90 top
U4  75.79,25.91 90 top
U5  75.75,45.31 90 top
U6  75.75,65.63 90 top
U7  75.67,15.62 90 top
U8  75.79,35.43 90 top
U9  75.62,55.36 90 top
U10  75.88,76.04 90 top

### Tracks (layer width: path | path; a pad name or v marks a point on that pad's centre or on a via)
5V
  Top 1.016: JP20.4 40,22.35 LED2.A
  Bottom 1.016: JP1.3 25.5,19.81 27.28,21.59 37.19,21.59 38.04,22.45 JP20.4
5V_REG
  pour Top: 30.58,9.14 30.58,16.51 29.82,17.27 29.82,20.07 34.14,20.07 36.55,17.65 36.55,12.06 33.63,9.14
A0
  Bottom 0.305: JP5.2 18.93,5.14 20.73,6.93 20.73,17.4 22.96,19.63 22.96,27.18 26.25,30.47 26.25,31.76 28.93,34.44 28.93,40.41 30.1,41.58 36.17,41.58 37.12,42.53
  Bottom 0.813: IC3.5 37.12,42.53
A1
  Bottom 0.305: IC3.4 37.85,44.83 31.34,44.83 27.41,40.89 27.41,35.18 22.07,29.84 22.07,27.94 19.66,25.53 19.66,16.13 16.8,13.27 | 16.8,13.27 16.74,13.21 | 16.8,13.27 11.04,13.27 JP15.2
A2
  Bottom 0.305: JP16.2 11.97,21.32 13.16,22.5 13.16,25.02 19.18,31.04 20.93,31.04 26.21,36.32 26.21,41.48 30.96,46.23 35.03,46.23 36.41,47.61 IC3.3
A_0
  Top 0.305: JP6.2 11.86,69.77 14.82,66.82 16.36,66.82 19.52,66.82 19.81,66.53 U1.1
A_1
  Top 0.305: JP7.2 11.42,61.61 14.07,64.26 16.61,64.26 17.88,65.53 18.23,65.88 U1.2
A_2
  Top 0.305: U1.3 21.39,65.23 20.17,64.01 20.17,53.85 19.29,52.97 11.26,52.97 JP8.2
A_3
  Top 0.305: 15.62,45.49 JP17.2 | U1.4 21.75,64.58 20.93,63.75 20.93,50.8
  Top 0.381: 20.93,50.8 15.62,45.49
A_4
  Top 0.305: U1.5 22.12,63.93 21.69,63.5 21.69,44.58 14.68,37.56 JP18.2
A_5
  Top 0.305: U1.24 31.26,63.93 31.22,63.88 31.22,59.44 30.33,58.55 30.33,46.48 18.14,34.29 18.14,30.73 16.82,29.42 JP19.2
GND  (via drill 0.65, 0.85, 0.9)
  Top 0.914: T3.E 69.19,32.89 71.98,30.1 v72.11,30.1 | T5.E 67.82,52.66 69.7,50.79 69.7,50.8 70.33,50.16 v70.33,49.4 | v77.19,49.53 77.19,52.52 U9.E | 71.86,9.53 v71.98,9.4
  Top 1.016: T1.E 71.35,9.53 71.86,9.53
  Bottom 0.914: v72.11,30.1 74.27,30.1 U8.E | C4.2 82.67,37.92 JP10.1 | v70.33,49.4 77.06,49.4 v77.19,49.53 | v71.98,9.4 72.24,9.65 76.43,9.65 76.94,10.16 U7.E
  pour Top (rank 2): -2.44,-1.78 -2.44,119.7 105.51,119.7 105.51,-1.78
  pour Bottom: -2.44,-0.51 -2.44,119.39 105.51,119.39 105.51,-0.51
N$1  (via drill 0.55)
  Top 0.305: 34.16,47.73 34.16,30.12 37.21,27.08 40.11,27.08
  Top 0.381: 40.41,26.77 40.11,27.08 | R1.P$2 34.09,47.8 34.16,47.73
  Top 0.508: 40.41,26.77 45.87,26.77 v46.28,26.36
  Bottom 0.61: 66.75,19.68 61.94,14.87
  Bottom 0.813: 91.36,19.76 89.53,21.59 83.29,21.59 81.38,19.68 66.75,19.68 | v46.28,26.36 46.28,22.45 | 61.94,14.87 53.07,14.87 53.21,14.73 | JP4.3 87.85,5.94 87.88,5.97
  Bottom 1.016: 87.88,5.97 87.88,9.91 91.36,13.39 91.36,19.76 | 46.28,22.45 46.89,21.84 49.5,21.84 53.06,18.29 53.06,14.88 53.07,14.87
N$2  (via drill 0.55)
  Top 0.305: 36.53,26.39 38.66,26.39 41.4,23.65 43.76,23.65 44.98,22.43 44.98,21.13
  Top 0.508: v82.78,16.03 86.33,16.03 88.87,18.57 JP3.3 | v60.66,7.37 60.53,7.24 53.82,7.24 53.21,7.85 53.21,11.15 44.93,19.43 44.98,19.48 44.98,21.13 | 32,49.05 32,41.17 33.1,40.08 33.1,29.82 36.53,26.39
  Top 0.813: R2.P$2 33.31,50.35 32,49.05
  Bottom 0.381: 76.35,14.33 78.38,14.33
  Bottom 0.508: v82.78,16.03 80.09,16.03 78.38,14.33 | 76.35,14.33 75.51,14.33
  Bottom 0.813: v60.66,7.37 64.97,7.37 68.91,11.3 73.89,11.3 74.65,12.06 74.65,13.46 75.51,14.33
N$3
  Top 0.813: Q9.B 71.22,4.57 70.26,5.54 70.26,7.72 68.2,9.78 R53.P$1
N$4
  Top 0.305: 57.28,12.22 R5.P$1
  Top 0.813: T1.B 67.28,17.65 64.19,17.65 59.56,13.03 R3.P$2 59.44,12.19 59.41,12.22 57.28,12.22
N$5
  Top 0.813: T1.C 67.77,15.6 67.77,15.57
  Top 1.016: 67.77,15.57 65.84,15.57 64.24,13.97 R6.P$2
N$6
  Bottom 0.305: R55.P$1 13.04,51.06 JP8.3
N$7
  Bottom 0.381: 75.21,16.94 81.38,16.94
  Bottom 0.508: 81.38,16.94 82.27,17.83 82.27,17.91
  Bottom 0.813: 75.21,16.94 73.99,18.16
  Bottom 1.016: C2.1 86.33,15.13 86.33,16.94 | 86.33,16.94 JP3.2 | 73.99,18.16 Q1.C | 86.33,16.94 84.81,16.94 83.85,17.91 82.27,17.91
N$8
  pour Top: 30.58,5.71 32.49,5.71 40.87,14.1 40.87,16.26 44.3,16.26 44.3,10.79 41.76,8.26 38.07,8.26 33.63,3.81 30.58,3.81
N$9
  Top 0.813: Q1.B 71.6,15.62 70.23,16.99 70.23,18.82 69.24,19.81 R6.P$1
N$10
  Bottom 0.305: 66.62,29.97 63.33,26.68 55.21,26.68 | 33.78,52.45 35.31,50.93 35.31,49.63 36.02,48.92 40.67,48.92 | 43.08,36.2 47.09,36.2
  Bottom 0.381: 71.58,27.18 78.79,27.18 | 55.21,26.68 54.71,27.18
  Bottom 0.508: 78.79,27.18 81.74,24.23 | 41.38,48.21 40.67,48.92 | 71.58,27.18 70.84,27.18 70.08,27.94 70.08,28.96 69.06,29.97 66.62,29.97 | 47.09,36.2 51.16,32.13
  Bottom 0.813: JP9.3 88.87,25.91 | 41.38,48.21 41.38,37.9 43.08,36.2 | 51.16,32.13 51.16,27.81 51.79,27.18 54.71,27.18 | R14.P$2 33.78,52.45
  Bottom 1.016: 88.87,25.91 87.2,24.23 81.74,24.23
N$11
  Bottom 0.305: R57.P$1 15,65.88 13.64,67.23 JP6.3
N$12
  Bottom 0.305: R56.P$1 16.57,59.07 JP7.3
N$13
  Top 0.305: U1.23 34.11,63.28
  Top 0.406: R44.P$1 35.98,61.4 34.11,63.28
N$14
  Top 1.27: R7.P$2 40.59,19.58 LED1.C
N$15
  Top 0.508: R10.P$2 42.31,24.89
  Top 1.016: LED2.C 46.3,24.41 45.82,24.89 42.31,24.89
N$16
  Bottom 1.016: R58.P$1 77.57,7.11 U3.C
N$18
  Bottom 0.305: R54.P$1 17.12,42.95 JP17.3
N$19
  Bottom 0.305: R46.P$1 19.86,38.56 16.33,35.02 JP18.3
N$20
  Bottom 0.305: T2.B 66.09,28.45 59.67,22.03 | 59.51,22.12 57.28,22.12 R16.P$1
  Bottom 0.813: 59.67,22.03 59.67,22.05 R15.P$2 59.51,22.12
N$21
  Top 1.016: R17.P$2 64.24,24.26 65.89,25.91 T2.C
N$22
  Bottom 0.381: 74.78,28.45 77.6,31.27 86.33,31.27
  Bottom 1.016: C4.1 86.33,32.62 86.33,31.27 JP9.2 | 74.78,28.45 Q2.C
N$23
  Top 0.813: R17.P$1 64.62,30.1 69.06,30.1 69.95,29.21 69.95,27.18 71.22,25.91 Q2.B
N$24  (via drill 0.35)
  Top 0.508: 42.24,52.25 42.24,38.86 42.39,38.71 48.21,38.71 50.72,36.2 v51.41,36.2
  Top 0.813: 42.24,52.25 38.61,55.88 33.78,55.88 R19.P$2
  Bottom 0.381: 66.52,39.76 63.34,36.58 60.48,36.58
  Bottom 0.508: 82.08,39.51 83.41,40.84 | v51.41,36.2 60.1,36.2 60.48,36.58
  Bottom 0.813: JP10.3 88.87,39.17 87.2,40.84 83.41,40.84 | 66.52,39.76 74.52,39.76 74.78,39.51 82.08,39.51
N$25
  Bottom 0.381: T3.B 65.94,37.97 61.52,33.55 61.21,33.55 60.43,32.77 60.45,32.77 59.82,32.14 R20.P$2
  Bottom 0.813: R20.P$2 R21.P$1
N$26
  Top 0.813: T3.C 67.79,35.41 67.77,35.38
  Top 1.016: 67.77,35.38 65.18,35.38 64.11,34.32 R22.P$2
N$27  (via drill 0.4)
  Top 0.381: v80.75,35.56 84.56,35.56 v84.68,35.69
  Bottom 0.381: v80.75,35.56 80.62,35.56 79.48,36.7 76.05,36.7 74.78,37.97 | v84.68,35.69 84.7,35.7 86.33,35.7
  Bottom 1.016: C6.1 86.33,35.7 JP10.2 | Q3.C 74.78,37.97
N$28
  Top 0.813: R22.P$1 64.24,39.75 69.32,39.75 70.08,38.99 70.08,36.45 71.09,35.43 Q3.B
N$29  (via drill 0.85)  (1 unrouted)
  Top 0.813: v56.49,47.62 54.76,45.89
  Bottom 0.305: 35.66,69.93 38,67.59 40.13,67.59 42.62,65.1 42.62,41.45 42.85,41.22 53.49,41.22 | 78.97,44.2 62.08,44.2
  Bottom 0.508: 88.42,45.21 86.77,43.56 79.6,43.56 78.97,44.2
  Bottom 0.813: 54.46,42.2 53.49,41.22 | 35.66,69.93 34.03,69.93 R24.P$2 | v56.49,47.62 58.65,47.62 62.08,44.2 | JP11.3 88.8,45.21 88.42,45.21
N$30
  Top 0.813: R26.P$1 57.25,42.24
  Top 1.016: 57.25,42.24 57.25,44.2 59.47,46.41 R25.P$2 | R26.P$1
  Bottom 0.381: 67.77,47.95 65.71,47.95 65.1,47.35 61.67,47.35 59.85,49.17
  Bottom 0.813: T4.B 67.77,47.95 | R25.P$2 59.85,49.44 59.85,49.17
N$31
  Top 0.813: R27.P$2 64.26,49.52
  Top 1.016: T4.C 65.98,45.42 64.26,47.14 64.26,49.52
N$32
  Bottom 0.381: 72.34,47.88 74.7,47.88 75.92,46.66 86.3,46.66
  Bottom 0.813: 86.3,46.66 JP11.2 | Q4.C
  Bottom 1.016: C7.1 86.3,52.16 86.3,46.66 | Q4.C 72.34,47.88
N$33
  Top 0.813: R27.P$1 65.21,41.95 65.89,41.27 70.21,41.27 70.21,44.58 71.01,45.38 Q4.B
N$34  (via drill 0.85)
  Top 0.508: v83.82,55.19 85.72,55.19 | 36.07,72.03 37.9,73.86 44.09,73.86 53.09,64.87 53.09,59.18 | v53.97,57.17 53.09,58.06 53.09,59.18 | 54.34,59.18 53.09,59.18
  Top 0.813: 88.97,58.44 85.72,55.19 | 36.07,72.03 33.48,72.03 33.46,72.02 R29.P$2
  Top 1.016: JP12.3 88.97,58.44
  Bottom 0.381: 79.6,55.07 79.73,55.19 | 78.71,54.18 61.44,54.18 59.87,55.75 58.01,55.75 56.59,57.17 v53.97,57.17
  Bottom 0.813: 79.6,55.07 78.71,54.18 | 79.73,55.19 v83.82,55.19
N$35
  Bottom 0.381: 59.47,59.65 R30.P$2 59.47,59.45 59.56,59.36
  Bottom 0.508: T5.B 67.61,57.78 61.14,57.78 59.56,59.36
  Bottom 0.813: 59.47,59.65 R31.P$1
N$36
  Top 0.813: R32.P$2 64.24,59.45
  Top 1.016: 64.24,59.45 64.24,57.02 65.8,55.45 T5.C
N$37
  Bottom 0.381: 74.55,57.94 75.84,56.64 86.43,56.64
  Bottom 0.813: Q5.C 72.34,57.94
  Bottom 1.016: C8.1 86.43,54.99 86.43,56.64 JP12.2 | 72.34,57.94 74.55,57.94
N$38  (via drill 0.3)
  Top 0.381: 72.27,55.42 70.05,57.63 70.05,58.29 v65.91,62.43 | v51.31,65.08 51.31,58.09 53.97,55.42 60.6,55.42 64.03,51.99
  Top 0.813: Q5.B 72.27,55.42 | R32.P$1 64.04,51.99 64.03,51.99
  Bottom 0.381: v65.91,62.43 62.79,65.56 51.79,65.56 v51.31,65.08
N$39  (via drill 0.35)
  Top 0.508: 54.88,62.01 54.71,61.84 v54.71,61.72
  Top 0.813: R34.P$2 34.04,75.11 45.21,75.11 54.97,65.35 54.97,62.09 54.88,62.01
  Bottom 0.305: 52.83,59.74 52.83,59.54 54.2,58.17 56.74,58.17 58.14,56.77 58.14,56.74
  Bottom 0.508: 52.83,59.74 52.83,60.45 54.1,61.72 v54.71,61.72 | 69.82,58.67 69.82,57.53 69.04,56.74 58.14,56.74
  Bottom 0.813: JP13.3 87.15,63.75 80.62,63.75 76.45,59.59 70.74,59.59 69.82,58.67
N$40
  Top 0.813: R36.P$1 | R36.P$1 57.25,62.05
  Top 1.016: 57.25,62.05 57.25,63.88 59.59,66.22 R35.P$2
  Bottom 0.813: R35.P$2 59.59,67.89 60.43,67.06 65.63,67.06 66.73,68.16 T6.B
N$41
  Top 0.813: T6.C | T6.C 67.77,65.56 | R37.P$2 64.19,61.98 | 64.19,61.98
  Top 1.016: 67.77,65.56 67.13,65.56 64.19,62.61 64.19,61.98
N$42
  Top 0.381: 85.06,66.93 85.18,66.81
  Top 0.508: 89.94,70.46 87.27,70.46 86.64,69.83 86.64,67.64
  Top 0.813: 85.5,66.5 85.18,66.81 | 90.83,73.51 90.83,71.35 89.94,70.46 | 85.06,66.93 84.77,67.23 80.83,67.23 78.21,69.85 75.54,69.85 73.81,68.12 | JP13.2 86.42,65.58 | C9.1 89.69,77.22 89.71,77.22
  Top 1.016: 89.71,77.22 89.71,74.62 90.83,73.51 | 86.64,67.64 85.5,66.5 86.42,65.58 | Q6.C 73.81,68.12
N$43
  Top 0.381: 72.26,65.63 72.26,65.86 69.67,68.45 69.67,68.61 68.76,69.52 64.19,69.52
  Top 0.813: Q6.B 72.27,65.63 72.26,65.63 | R37.P$1 64.15,69.55 64.19,69.52
N$44
  Top 0.305: R45.P$1 15.01,26.12 14.24,26.88 JP19.3
N$45
  Top 0.305: R52.P$1 14.84,4.83 12.61,2.6 JP5.3
N$46  (via drill 0.35)
  Top 0.305: v13.18,14.86 13.18,12.87 JP15.3
  Bottom 0.305: R51.P$1 13.18,18.89 v13.18,14.86
N$47
  Top 0.305: R50.P$1 20.09,22.27 17.87,20.05 13.77,20.05 12.5,18.78 JP16.3
N$48
  Bottom 0.508: R47.P$1 31.54,39.99 IC3.6
N$49
  Top 0.406: 71.22,77.32 73.56,77.32
  Top 0.508: 86.51,74.78 76.1,74.78 73.56,77.32 | 71.22,77.32 70.21,78.33
  Top 0.813: JP14.3 88.97,72.32 86.51,74.78 | R39.P$2 33.46,77.28 33.48,77.29
  Top 1.016: 33.48,77.29 45.82,77.29 50.29,81.76 53.85,81.76 67.82,81.76 70.21,79.38 70.21,78.33
N$50
  Top 0.305: 67.92,7.19 T9.B
  Top 0.813: 67.92,7.19 63.65,7.19 59.7,3.24 R48.P$2 R49.P$1
N$51
  Top 0.381: 67.92,4.67 T9.C
  Top 1.016: 67.92,4.67 65.61,4.67 64.36,3.43 R53.P$2
N$52
  Top 0.813: R41.P$1 57.25,72.19
  Top 1.016: 57.25,72.19 57.25,75.06 59.59,77.4 R40.P$2
  Bottom 0.813: R40.P$2 59.59,78.56 60.43,77.72 65.76,77.72 66.61,78.57 T7.B
N$53
  Bottom 0.381: 79.4,5.89 75.62,5.89
  Bottom 0.813: JP4.2 85.31,7.9 81.41,7.9 79.4,5.89 | 75.62,5.89 74.4,7.11
  Bottom 1.016: C14.1 84.16,12.72 85.31,11.56 85.31,7.9 | 74.4,7.11 Q9.C
N$54
  Top 1.016: R42.P$2 64.2,76.49 64.66,76.03 T7.C
N$55
  Top 0.813: Q7.C 72.46,78.56 72.49,78.59
  Top 1.016: 72.49,78.59 74.09,78.59 76.33,80.82 81.58,80.82 84.2,78.21 C10.1
  Bottom 1.016: C10.1 86.43,75.02 JP14.2
N$56
  Top 0.813: Q7.B 71.39,75.99 70.21,74.8 70.21,72.01
  Top 1.016: R42.P$1 65.97,72.05 66.78,71.25 69.44,71.25 70.21,72.01
N$57
  Top 0.381: 80.11,2.08 R58.P$2
  Top 0.508: R58.P$2 80.44,2.36 LED3.C
N$58
  Bottom 0.305: 77.06,4.52 U3.B
  Bottom 0.381: 65.66,3.38 73.94,3.38
  Bottom 0.813: 77.06,4.52 75.08,4.52 73.94,3.38 | 65.66,3.38 64.97,4.06 62.33,4.06 61.82,3.56 61.82,2.4 R59.P$2
N$59
  Bottom 0.813: R60.P$1 79.86,28.45
  Bottom 1.016: 79.86,28.45 U4.C
N$60
  Top 0.508: 81.18,22.12 82.32,23.27 84.32,23.27
  Top 0.813: LED4.C 84.32,23.27 | R60.P$2 81.15,22.12 81.18,22.12
N$61
  Bottom 0.305: 77.06,25.86 U4.B
  Bottom 0.381: 63.98,24.56 74.02,24.56
  Bottom 0.813: 77.06,25.86 75.31,25.86 74.02,24.56 | R61.P$2 61.91,22.49 63.98,24.56
N$62
  Bottom 1.016: R62.P$1 80.19,47.85 U5.C
N$63
  Top 0.508: 88.26,42.16 87.6,42.16 86.13,40.69 82.04,40.69 81.36,41.37
  Top 0.813: LED5.C 88.31,42.21 88.26,42.16 | R62.P$2 81.36,41.37
N$64
  Bottom 0.152: 76.99,45.36 74.47,45.36 73.02,46.81 71.12,46.81 68.83,49.1 65.86,49.1 64.8,48.03 63.2,48.03 62.27,48.96
  Bottom 0.813: R63.P$2 62.27,49.25 62.27,48.96 | U5.B 76.99,45.34 76.99,45.36
N$65
  Bottom 0.508: 80.24,67.96 80.24,67.95
  Bottom 1.016: R64.P$1 80.24,67.96 | 80.24,67.95 77.24,67.95 U6.C
N$66
  Top 0.508: 82.27,61.04 86.13,61.04 87.6,62.51 88.29,62.51
  Top 0.813: LED6.C 88.29,62.51 | R64.P$2 81.62,61.69 82.27,61.04
N$67
  Top 0.406: 70.43,64.36 74.04,64.36
  Top 0.508: 62.5,66.8 69.19,66.8
  Top 0.813: 74.04,64.36 75.23,65.56 76.99,65.56 77.02,65.59 U6.B | 70.43,64.36 70.05,64.75 70.05,65.94 69.19,66.8 | R65.P$2 61.86,67.44 62.5,66.8
N$68
  Top 0.381: 90.25,9.78 R66.P$1
  Top 0.508: 79.55,14.35 81.18,12.72 87.3,12.72
  Top 0.813: U7.C 78.59,18.16 79.55,17.2 79.55,14.35 | 90.25,9.78 87.3,12.72
N$69
  Top 0.508: R66.P$2 90.27,6.6 87.04,9.83 LED7.C
N$70
  Bottom 0.381: 63.4,14.28 73.76,14.28
  Bottom 0.813: 73.76,14.28 75.06,15.57 76.91,15.57 76.94,15.6 U7.B | R67.P$2 61.88,12.76 63.4,14.28
N$71
  Top 0.813: U8.C 77.06,37.52 77.5,37.08 91.06,37.08 93.19,34.95 93.19,31.37 R68.P$1
N$72
  Top 0.508: R68.P$2 91.54,27.05 88.7,29.89 LED8.C
N$73
  Bottom 0.152: 77.06,35.38 U8.B
  Bottom 0.381: 63.33,33.8 63.59,33.8
  Bottom 0.508: 75.03,35.38 75.03,32.64 73.63,31.24 66.4,31.24 65.76,31.88 65.76,32.89 64.86,33.8
  Bottom 0.813: 75.03,35.38 77.06,35.38 | 63.59,33.8 64.86,33.8 | R69.P$2 61.81,32.27 63.33,33.8
N$74
  Top 0.508: 81.15,56.16 81.15,52.43 82.78,50.8
  Top 0.813: 81.15,56.16 79.45,57.86 76.91,57.86 76.91,57.88 U9.C | 82.78,50.8 89.46,50.8 91.31,48.95 | R70.P$1 91.31,48.95 | 91.31,48.95
N$75
  Top 0.508: R70.P$2 91.33,45.93 88.45,48.81
  Top 1.016: 88.45,48.81 LED9.C
N$76  (via drill 0.7, 0.85)
  Top 0.813: R71.P$2 61.78,56.94 v65.63,53.09 | v79.6,51.31 79.6,54.36 78.6,55.36 U9.B
  Bottom 0.508: 67.16,51.05 65.63,52.58 v65.63,53.09
  Bottom 0.813: v79.6,51.31 79.35,51.05 67.16,51.05
N$77
  Bottom 0.381: 81.25,71.63 81.89,71.63 84.11,69.4
  Bottom 0.813: U10.C 78.24,78.58 79.96,76.86 79.96,76.83 79.98,76.81 79.98,72.9 81.25,71.63 | 84.11,69.4 91.57,69.4 91.57,69.39 R72.P$1
N$78
  Top 0.508: R72.P$2 91.59,66.5 89.21,68.88 LED10.C
N$79
  Bottom 0.813: U10.B 77.14,76.07
  Bottom 1.016: R73.P$2 61.91,80.48 63.3,81.86 73.05,81.86 74.9,80.01 74.9,77.47 76.3,76.07 77.14,76.07
PWM_0
  Top 0.305: U1.13 29.12,58.73 30.35,59.96 30.35,75.92
  Top 0.508: R39.P$1 29.03,77.24 30.35,75.92
PWM_1
  Top 0.305: U1.12 28.62,59.38 29.64,60.4 29.64,74.09 29.2,74.54
  Top 0.508: 29.2,74.54 R34.P$1
PWM_2
  Top 0.305: 27.08,71.96 28.93,70.1 28.93,60.69 28.26,60.03 U1.11
  Top 0.508: 27.08,71.96 R29.P$1
PWM_3
  Top 0.305: U1.10 27.89,60.68 28.22,61.01 28.22,68.15 27.01,69.36
  Top 0.508: 27.01,69.36 R24.P$1
PWM_4
  Top 0.305: U1.9 25.11,61.33 24.69,60.91 24.69,57.45 26.15,55.99
  Top 0.813: 26.15,55.99 R19.P$1
PWM_5
  Top 0.305: U1.8 24.49,61.98 23.98,61.47 23.98,54.36 25.2,53.13
  Top 0.813: 25.2,53.13 R14.P$1
PWM_6
  Top 0.305: U1.7 23.49,62.63 23.22,62.36 23.22,51.31 24.23,50.29
  Top 0.813: 24.23,50.29 26.09,50.29 R2.P$1
PWM_7
  Top 0.305: U1.6 22.68,63.28 22.45,63.05 22.45,49.02 23.67,47.8
  Top 0.813: 23.67,47.8 R1.P$1
SCL  (via drill 0.35)
  Top 0.305: U1.26 34.82,65.23 v36.3,63.75 | R9.P$1 37.54,28.62
  Top 0.508: 37.54,28.62 35.56,30.61 35.56,51.56 36.58,52.58 37.97,52.58 IC3.1
  Bottom 0.305: v36.3,63.75 36.34,63.8 36.41,63.74
  Bottom 0.508: R9.P$1 33.42,28.62 30.42,25.62 JP20.1 | IC3.1 38.09,56.76 36.41,58.44 36.41,63.74
SDA  (via drill 0.35)
  Top 0.305: U1.27 39.63,65.88 v39.73,65.79
  Top 0.508: R8.P$1 41,28.47 41,47.12 38.09,50.02 IC3.2
  Bottom 0.508: R8.P$1 39.19,26.67 33.63,26.67 32.96,26 JP20.2 | 38.23,50.29 IC3.2 39.48,50.15 40.74,51.41 40.74,64.77 v39.73,65.79
SERVO_0
  Bottom 0.508: R59.P$1
  Bottom 0.813: R59.P$1 R48.P$1 59.7,9.06 58.14,7.49 54.2,7.49 51.31,10.39 51.31,12.5 44.68,19.13 44.68,32.33 44.72,32.37 IC3.10
SERVO_1
  Top 0.813: IC3.11 46.47,34.91 53.09,28.3 53.09,18.59 54.51,17.17 58.5,17.17 59.56,18.24 R3.P$1
  Bottom 0.508: R3.P$1 61.8,19.81 R67.P$1
SERVO_2
  Bottom 0.305: 53.77,28.22 58.09,28.22 59.05,29.18
  Bottom 0.381: 53.77,28.22 53.16,28.22 52.81,28.57 52.81,32.13 47.49,37.45 IC3.12
  Bottom 0.508: R15.P$1 61.85,29.79 R61.P$1
  Bottom 0.813: R15.P$1 59.56,29.69 59.05,29.18
SERVO_3
  Top 0.813: R20.P$1 59.44,38 58.65,37.21 54,37.21 51.26,39.95 45.71,39.95 IC3.13
  Bottom 0.508: R69.P$1 61.67,39.76 R20.P$1
SERVO_4
  Bottom 0.508: R63.P$1 61.7,42.2
  Bottom 0.813: 61.7,42.2 R25.P$1 59.47,43.63 57.38,45.72 50.52,45.72 47.22,42.42 47.1,42.53 IC3.14
SERVO_5
  Top 0.813: R30.P$1 59.47,53.1 58.19,54.38 54.69,54.38 45.71,45.4 IC3.15
  Bottom 0.508: R71.P$1 61.66,52.14 R30.P$1
SERVO_6
  Bottom 0.508: R35.P$1 61.78,62.02 R65.P$1
  Bottom 0.813: IC3.16 47.46,47.61 51.23,51.38 51.23,62.92 52.45,64.14 58.52,64.14 59.59,63.06
  Bottom 1.016: R35.P$1 59.59,63.06
SERVO_7
  Bottom 0.508: R73.P$1 61.75,72.18 R40.P$1 59.54,72.18 57.89,73.84 56.44,73.84 49.89,67.28
  Bottom 0.813: IC3.17 46.95,50.15 49.89,53.09 49.89,67.28
VCC  (via drill 0.5, 1)
  Top 0.381: U1.28 33.35,66.53 33.76,66.93 | C3.1 43,69.6 | 74.53,52.88 74.57,52.83 74.78,52.63
  Top 0.508: 84.53,68.91 81.94,71.5 74.4,71.5 72.49,73.41 | 84.73,29.82 85.72,29.82 87.43,28.12 88.9,28.12 90.25,26.77 90.25,23.98 89.95,23.68 LED4.A | 84.66,62.53 83.46,63.73 80.85,63.73 77.58,60.46 74.57,60.46 | LED5.A 83.37,42.59 81.89,44.07 | 81.89,44.07 81.89,46.74 83.64,48.49 84.68,48.49 | 74.9,39.88 75.54,40.51 77.7,40.51 81.25,44.07 81.89,44.07 | 75.03,11.43 82.02,11.43 83.49,9.96 | LED7.A 83.34,9.96 80.39,7.01 80.39,5.49 81.53,4.34 86.49,4.34 87.34,3.49 LED3.A | 84.6,29.89 83.29,31.21 | 83.29,31.24 83.03,31.5 74.65,31.5 | R57.P$2 17.15,69.86 R56.P$2 | v42.39,30.73 42.65,30.48 46.2,30.48 48.27,28.41 | 33.76,66.93 34.29,67.46 v35.89,67.46 | R52.P$2 22.46,22.1 23.6,23.24 25.12,23.24 25.17,23.19
  Top 0.813: 74.78,40.01 74.9,39.88 | 74.57,33.71 74.65,33.78 74.65,32.89 | 74.65,11.05 75.03,11.43 | 83.49,9.96 LED7.A | 84.6,29.89 LED8.A 84.73,29.82 | 83.29,31.21 83.29,31.24 | 25.17,23.42 25.16,23.4 R51.P$2 25.17,23.23 25.17,23.19 | Q7.E 72.49,73.42 72.49,73.41 | 27.76,28.68 R50.P$2 27.71,28.55 | 30.12,28.68 30.16,28.64 R9.P$2 30.16,28.79 | LED10.A 84.76,68.91 | LED9.A 84.68,48.49 | 27.99,18.54 JP1.2 27.91,18.41 | R47.P$2 30.82,31.65 30.81,31.65 | 74.73,2.03 74.82,2.12
  Top 1.016: 84.76,68.91 84.53,68.91 | 74.57,52.83 74.57,60.46 74.57,61.34 72.88,63.04 Q6.E | 74.78,52.63 74.78,42.67 | 74.78,42.67 74.78,40.01 | 43,69.6 43,67.8 48.11,62.7 48.11,60.15 C12.1 | LED6.A 84.66,62.53 | 74.9,39.88 74.57,39.55 74.57,33.71 | 74.52,23.5 74.52,24.13 74.65,24.26 74.65,31.5 74.65,32.89 Q3.E | 74.65,13.08 74.65,23.5 74.52,23.5 | 74.65,13.08 74.65,11.05 74.65,10.03 74.82,9.87 74.82,2.12 | Q9.E 74.73,2.03 | Q5.E 74.53,52.88 | Q4.E 72.5,42.67 74.78,42.67 | Q2.E 72.49,23.5 74.52,23.5 | Q1.E 74.65,13.08 | 26.8,28.68 27.76,28.68 | R8.P$2 48.27,28.41 | 30.16,28.79 30.81,29.44
  Top 2: C3.1 42.13,69.22 C11.2 37.64,69.22 v35.89,67.46
  Top 2.54: 27.99,18.54 27.99,20.37 25.17,23.19 | 30.12,28.68 27.76,28.68 | 30.81,31.65 30.81,29.44 | 25.17,23.42 25.17,26.01 27.71,28.55 | v21.44,34.04 26.8,28.68
  Bottom 0.508: R47.P$2 31.82,30.71 42.36,30.71 | 15.04,31.95 16.26,31.95 19.89,35.59 | R46.P$2 22.57,47.23 | R54.P$2 22.53,51.01 | R55.P$2 22.29,57.11 | R56.P$2 20.33,68.57 23.09,65.81
  Bottom 0.813: C12.1 45.22,55.99 45.22,53.18 | v42.39,30.73 42.36,30.71 | 14.66,57.1 14.64,57.11 R55.P$2 14.74,57.11 14.81,57.17 | R45.P$2 15.01,31.92 15.04,31.95
  Bottom 0.914: IC3.18 45.22,53.18
  Bottom 1.016: 53.57,75.46 54.33,75.46 | Q6.E 74.44,63.04 74.68,63.27 74.68,71.22 74.27,71.63 72.49,71.63 | 63.32,75.46 67.16,71.63 72.49,71.63 | Q7.E 72.49,73.42 72.49,71.63
  Bottom 2: 23.09,47.75 23.09,38.79 19.89,35.59 v21.44,34.04 | v35.89,67.46 34.24,65.81 23.09,65.81 23.09,57.91 | 63.32,75.46 54.33,75.46 44.2,75.46 42.76,74.03 C3.1 | 23.09,47.75 23.09,51.56 | 23.09,51.56 23.09,57.91 | 22.57,47.23 23.09,47.75 | 22.53,51.01 23.09,51.56 | 22.29,57.11 23.09,57.91

### Text on the board
tPlace: I2C servo driver | 1=GND / 2=ADDR / 3=VCC | GND VCC PWM | A0 | GND VCC PWM | A1 | GND VCC PWM | A2 | PWM | GND VCC PWM | A3 | GND VCC PWM | A4 | A5 | GND VCC PWM | SCL SDA GND +5V | GND VCC PWM | A2 | +5V | REG | A1 | GND VCC PWM | A0
bPlace: Designed by Surepic / / 8 output servo power driver / / 1.25A peak per output / / 3A max peak current